# EAGLE design seven-segment-helper-board (EAGLE 7.3.0)
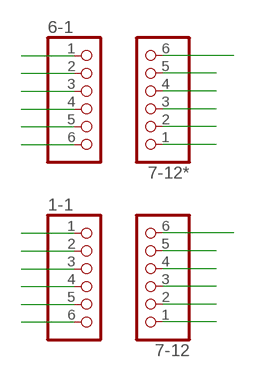
[diagram p0: schematic, sheet 1]

## Parts
1-1  PINHD-1X6  [1X06]
6-1  PINHD-1X6  [1X06]
7-12  PINHD-1X6  [1X06]
7-12*  PINHD-1X6  [1X06]

## Nets
1: 1-1.1 6-1.1
2: 1-1.2 6-1.2
3: 1-1.3 6-1.3
4: 1-1.4 6-1.4
5: 1-1.5 6-1.5
6: 1-1.6 6-1.6
7: 7-12*.1 7-12.1
8: 7-12*.2 7-12.2
9: 7-12*.3 7-12.3
10: 7-12*.4 7-12.4
11: 7-12*.5 7-12.5
12: 7-12*.6 7-12.6

## Library data of the parts
1-1 6-1 7-12 7-12* = pinhead:PINHD-1X6: PIN HEADER

## Board
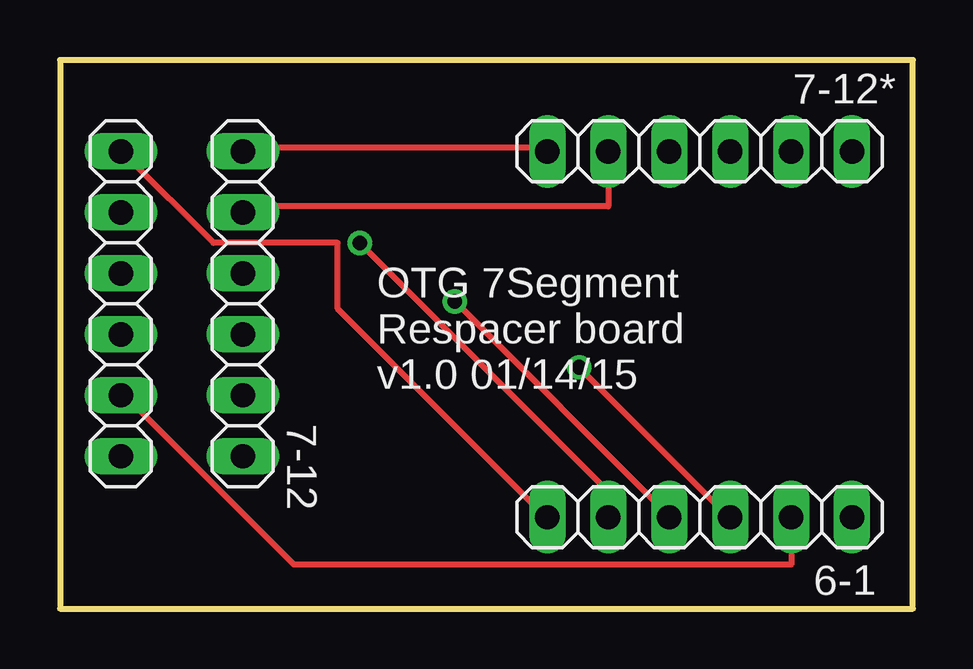
[diagram p1: board, top side]
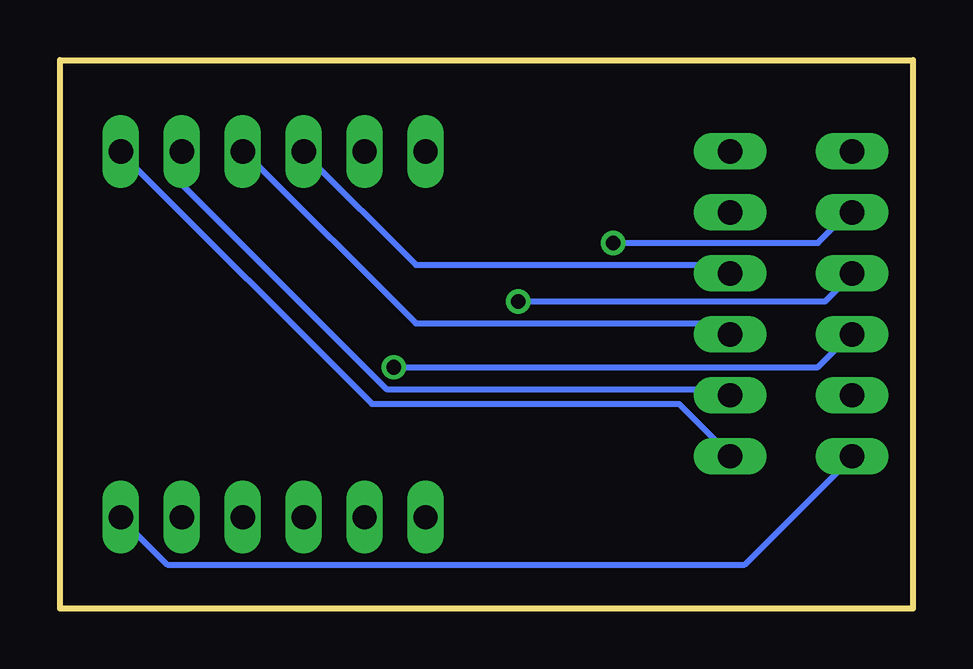
[diagram p2: board, bottom side, seen from below]

Size 35.56 x 22.86 mm. Coordinates in mm from the lower left corner, seen from the top.
Outline: 0,0 35.56,0 35.56,22.86 0,22.86 0,0
Copper layers (1*16): Top 0.035mm / dielectric 1.5mm / Bottom 0.035mm
Design rules "default *": minimum track width 10mil, minimum drill 24mil, track to track 8mil, track to pad 8mil, pad to pad 8mil, via to via 8mil, smd to smd 8mil, copper to edge 40mil, drill to drill 8mil, minimum pad ring 10mil, minimum via ring 8mil, stop-mask expansion 4mil, vias tented up to drill 25mil, thermal gap 10mil

### Footprints (pad centres in the part's own frame; a part is rotated, then mirrored left to right if it is on the bottom)
1X06 = drill 1.016 long: 1 -6.35,0; 2 -3.81,0; 3 -1.27,0; 4 1.27,0; 5 3.81,0; 6 6.35,0

### Placement (x,y rotation side)
1-1  2.54,12.7 90 top
6-1  26.67,3.81 180 top
7-12  7.62,12.7 270 top
7-12*  26.67,19.05 0 top

### Tracks (layer width: path | path; a pad name or v marks a point on that pad's centre or on a via)
1
  Bottom 0.254: 1-1.1 2.74,6.1 7.01,1.83 31.09,1.83 32.92,3.66 6-1.1
2
  Top 0.254: 6-1.2 30.48,1.83 9.75,1.83 2.74,8.84 1-1.2
3  (via drill 0.61)
  Top 0.254: v21.64,10.06 27.74,3.96 6-1.3
  Bottom 0.254: v21.64,10.06 3.96,10.06 2.74,11.28 1-1.3
4  (via drill 0.61)
  Top 0.254: v16.46,12.8 25.3,3.96 6-1.4
  Bottom 0.254: v16.46,12.8 3.66,12.8 2.74,13.72 1-1.4
5  (via drill 0.61)
  Top 0.254: v12.5,15.24 22.86,4.88 6-1.5
  Bottom 0.254: v12.5,15.24 3.96,15.24 2.74,16.46 1-1.5
6
  Top 0.254: 1-1.6 2.74,18.9 6.4,15.24 11.58,15.24 11.58,12.5 20.12,3.96 6-1.6
7
  Top 0.254: 7-12.1 7.62,19.2 20.12,19.2 7-12*.1
8
  Top 0.254: 7-12*.2 22.86,16.76 7.62,16.76 7-12.2
9
  Bottom 0.254: 7-12.3 7.62,14.02 7.92,14.33 20.73,14.33 25.3,18.9 7-12*.3
10
  Bottom 0.254: 7-12.4 7.62,11.58 7.92,11.89 20.73,11.89 27.74,18.9 7-12*.4
11
  Bottom 0.254: 7-12*.5 30.48,17.68 21.95,9.14 7.62,9.14 7-12.5
12
  Bottom 0.254: 7-12.6 7.62,6.4 9.75,8.53 22.55,8.53 32.92,18.9 7-12*.6

### Text on the board
tNames: OTG 7Segment / Respacer board / v1.0 01/14/15